# Altium schematic sheet TOP.SchDoc: TOP
size A4; Author: Schiechtl Alexander; Revision: 1.0; SheetNumber: 1; SheetTotal: 6; Project: 3D-Scanner
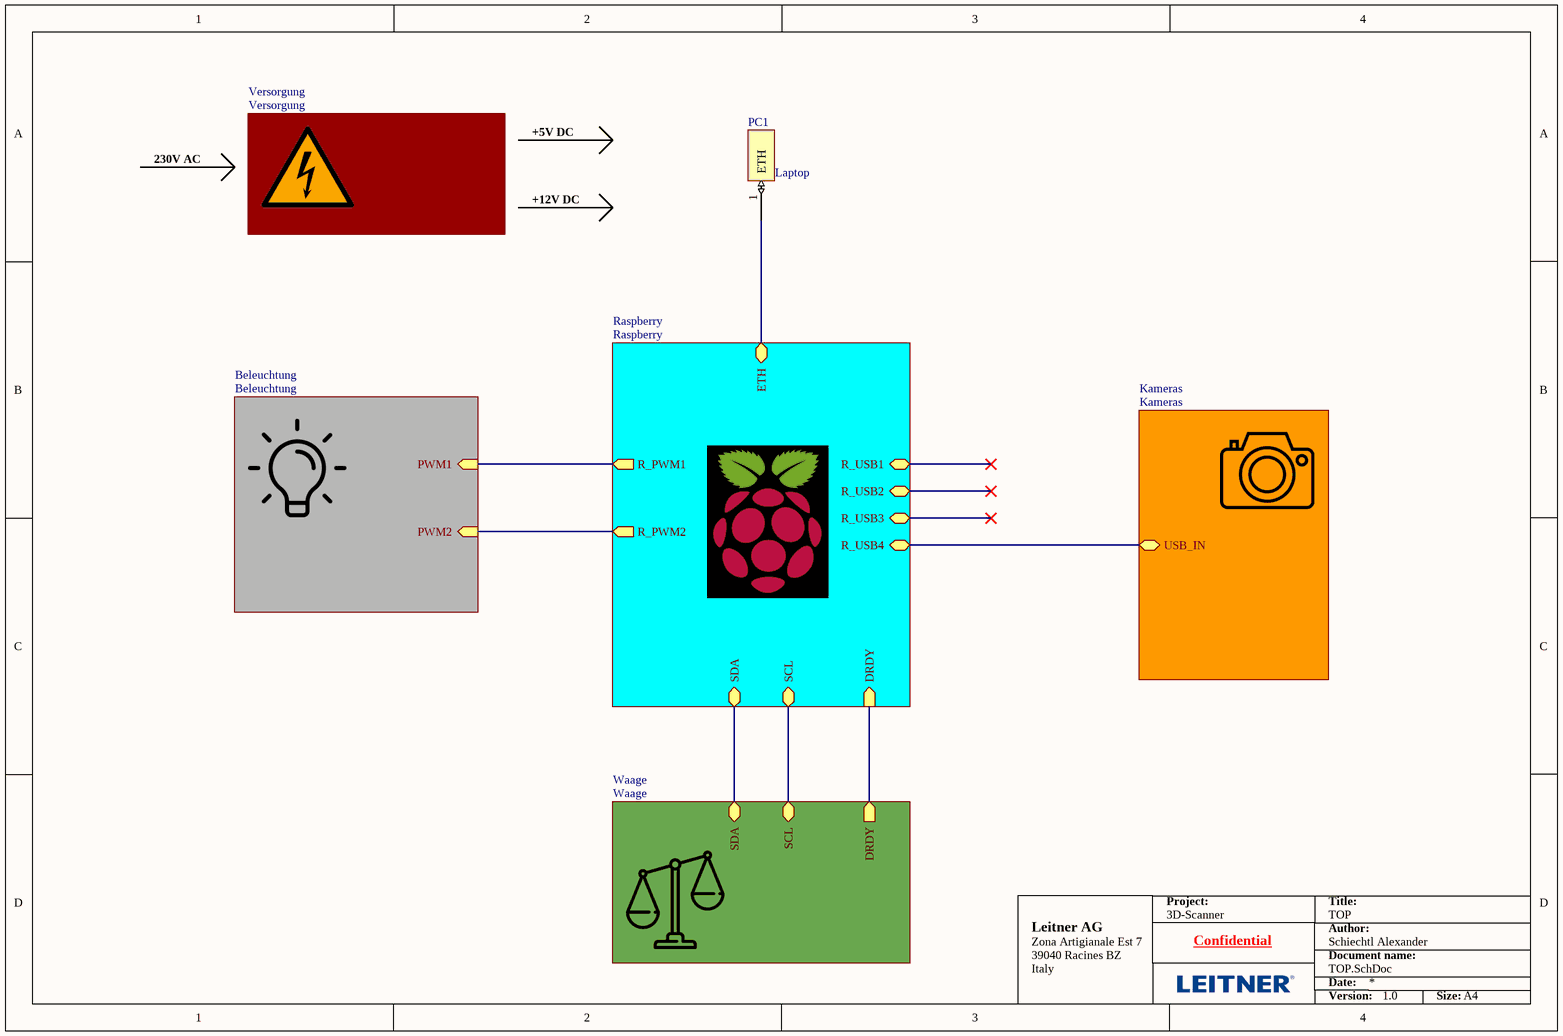
[diagram p0: TOP.SchDoc]

## Parts
PC1  Laptop

## Sub-sheets
Beleuchtung = Beleuchtung: PWM1 (in), PWM2 (in)
Kameras = Kameras: USB_IN (bidir)
Raspberry = Raspberry: R_USB1 (bidir), R_USB2 (bidir), R_USB3 (bidir), R_USB4 (bidir), SCL (bidir), SDA (bidir), DRDY (in), ETH (bidir), R_PWM1 (out), R_PWM2 (out)
Versorgung = Versorgung: no entries
Waage = Waage: SCL (bidir), SDA (bidir), DRDY (out)

## Nets
NetPC1_1: PC1.1(ETH) ; sheet Raspberry/ETH
(unnamed): sheet Kameras/USB_IN, sheet Raspberry/R_USB4
(unnamed): sheet Raspberry/SCL, sheet Waage/SCL
(unnamed): sheet Raspberry/SDA, sheet Waage/SDA
(unnamed): sheet Raspberry/R_PWM1, sheet Beleuchtung/PWM1
(unnamed): sheet Raspberry/R_PWM2, sheet Beleuchtung/PWM2

## Buses and harness runs
bus sheet Raspberry/DRDY = sheet Waage/DRDY

## Notes on the sheet
- 230V AC
- +5V DC
- +12V DC
- Project:
- Title:
- Leitner AG
- Zona Artigianale Est 7
- 39040 Racines BZ
- Italy
- Confidential
- Author:
- Document name:
- Date:
- Version:
- Size:
- A4